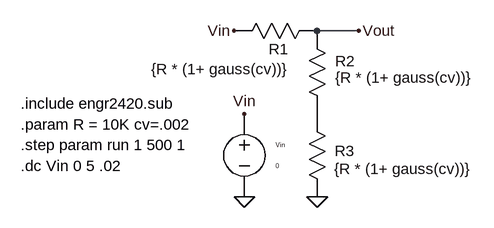
[diagram p0: schematic Experiment 1.asc]
Experiment 1.asc, the LTspice schematic file:
Version 4
SHEET 1 880 680
WIRE 336 144 272 144
FLAG 336 144 Vout
FLAG 160 400 0
FLAG 160 272 Vin
FLAG 144 144 Vin
FLAG 272 400 0
SYMBOL cktsym\\resistor 208 144 R90
WINDOW 3 43 85 VTop 2
WINDOW 0 44 -5 VBottom 2
SYMATTR Value {R * (1+ gauss(cv))}
SYMATTR InstName R1
SYMBOL cktsym\\vsource 160 336 R0
WINDOW 123 0 0 Left 0
WINDOW 39 0 0 Left 0
SYMATTR InstName Vin
SYMATTR Value 0
SYMBOL cktsym\\resistor 272 208 R0
WINDOW 3 28 8 Left 2
WINDOW 0 28 -17 Left 2
SYMATTR Value {R * (1+ gauss(cv))}
SYMATTR InstName R2
SYMBOL cktsym\\resistor 272 336 R0
WINDOW 3 26 21 Left 2
WINDOW 0 27 -7 Left 2
SYMATTR Value {R * (1+ gauss(cv))}
SYMATTR InstName R3
TEXT -184 256 Left 2 !.include engr2420.sub
TEXT -184 352 Left 2 !.dc Vin 0 5 .02
TEXT -184 288 Left 2 !.param R = 10K cv=.002
TEXT -184 320 Left 2 !.step param run 1 500 1

The netlist it stands for:
* Experiment 1.asc
R1 Vout Vin {R * (1+ gauss(cv))}
Vin Vin 0 0
R2 Vout P001 {R * (1+ gauss(cv))}
R3 P001 0 {R * (1+ gauss(cv))}
.include engr2420.sub
.dc Vin 0 5 .02
.param R = 10K cv=.002
.step param run 1 500 1
.backanno
.end